# Altium schematic sheet RTC.SchDoc
size 165 x 127 mm
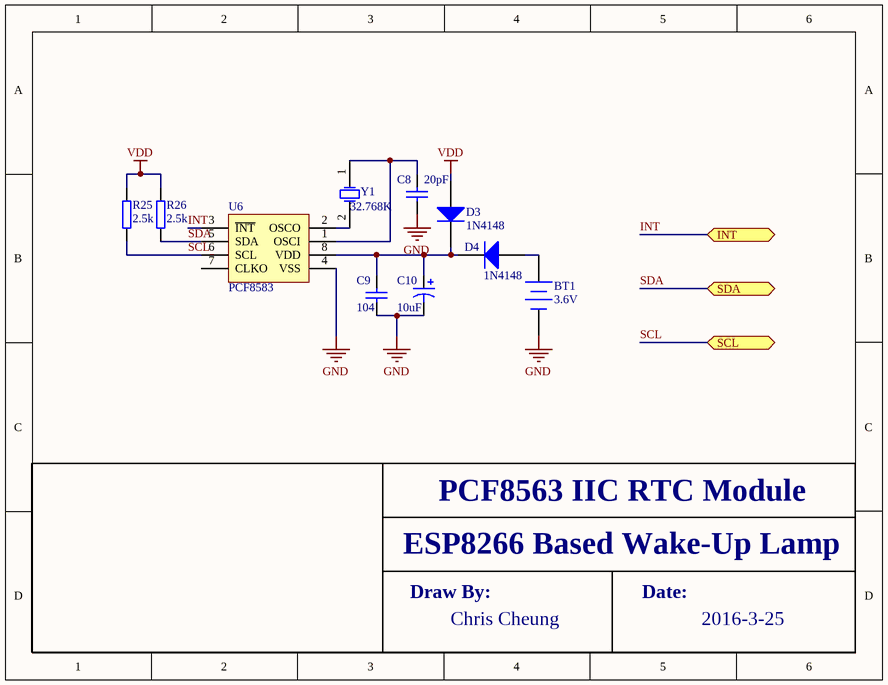
[diagram p0: RTC.SchDoc]

## Parts
BT1  3.6V  [BAT-2]
C8  value 20pF  [RAD-0.3]  (hidden comment: Cap)
C9  value 104  [RAD-0.3]  (hidden comment: Cap)
C10  value 10uF  [C0805]  (hidden comment: Cap Pol3)
D3  1N4148  [DO-41]
D4  1N4148  [DO-41]
R25  2.5k  [SMT_R_0402]
R26  2.5k  [SMT_R_0402]
U6  value PCF8583  (hidden comment: Real Time)
Y1  value 32.768K  [R38]  (hidden comment: SMD)

## Ports
INT (bidir), SCL (bidir), SDA (bidir)

## Nets
GND: BT1.2(-) C8.1 C9.1 C10.2 U6.4(VSS)
VDD: D3.1(A) R25.2 R26.2
INT: U6.3(~{INT}) ; port INT
SCL: R25.1 U6.6(SCL) ; port SCL
SDA: R26.1 U6.5(SDA) ; port SDA
NetBT1_1: BT1.1(+) D4.1(A)
NetC8_2: C8.2 U6.1(OSCI) Y1.1(OSC1)
NetC9_2: C9.2 C10.1 D3.2(K) D4.2(K) U6.8(VDD)
NetU6_2: U6.2(OSCO) Y1.2(OSC2)

Not connected (* = marked no-connect by the designer): U6 7(CLKO)

## Notes on the sheet
- PCF8563 IIC RTC Module
- ESP8266 Based Wake-Up Lamp
- Draw By:
- Chris Cheung
- Date:
- 2016-3-25

## Library data of the parts
BT1 = Battery: Multicell Battery; Published: 24-Mar-1999; LatestRevisionDate: 17-Jul-2002; LatestRevisionNote: Re-released for DXP Platform.; PackageReference: BAT-2; Publisher: Altium Limited; PackageDescription: Battery; 2 Leads
C8 C9 = Cap: Capacitor; Published: 8-Jun-2000; LatestRevisionDate: 17-Jul-2002; LatestRevisionNote: Re-released for DXP Platform.; PackageReference: RAD-0.3; Publisher: Altium Limited; PackageDescription: Radial Cap, Thru-Hole; 2 Leads; 0.3 in Pin Spacing
C10 = Cap Pol3: Polarized Capacitor (Surface Mount); Published: 8-Jun-2000; LatestRevisionDate: 29-May-2009; LatestRevisionNote: IPC-7351 Footprint Added.; PackageReference: C0805; Publisher: Altium Limited; PackageDescription: Chip Capacitor
D3 D4 = Diode 1N4001: 1 Amp General Purpose Rectifier; Published: 8-Jun-2000; LatestRevisionDate: 17-Jul-2002; LatestRevisionNote: Re-released for DXP Platform.; DatasheetVersion: 1998; PackageVersion: Aug-1999; PackageReference: DO-41; Publisher: Altium Limited; PackageDescription: Diode, Axial; Body 5.2 x 2.7 mm (LxDia. max), Lead Dia. 0.86 mm (max); Code_JEDEC: DO-204-AL; ComponentLink1Description: Manufacturer Link; ComponentLink1URL: http://www.fairchildsemi.com/; ComponentLink2Description: Datasheet; ComponentLink2URL: http://www.fairchildsemi.com/ds/1N%2F1N4001.pdf
R25 R26 = SMT_R_0402: Surface mount resistor 0402
U6 = PCF8583
Y1 = XTAL: Crystal Oscillator; Published: 8-Jun-2000; LatestRevisionDate: 17-Jul-2002; LatestRevisionNote: Re-released for DXP Platform.; PackageReference: R38; Publisher: Altium Limited; PackageDescription: Crystal, Thru-Hole; 2 Leads; Body 3.1 x 8.2 mm (Dia.xH)